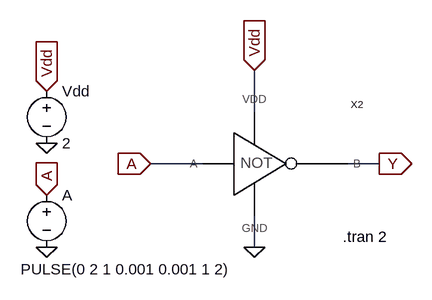
[diagram p0: schematic NOT_SYM_TESTING.asc]
NOT_SYM_TESTING.asc, the LTspice schematic file:
Version 4
SHEET 1 880 680
WIRE 208 112 208 48
WIRE 128 192 48 192
WIRE 400 192 352 192
WIRE 208 320 208 272
FLAG 208 320 0
FLAG -112 320 0
FLAG -112 160 0
FLAG 208 48 Vdd
IOPIN 208 48 In
FLAG 48 192 A
IOPIN 48 192 In
FLAG 400 192 Y
IOPIN 400 192 Out
FLAG -112 80 Vdd
IOPIN -112 80 In
FLAG -112 240 A
IOPIN -112 240 In
SYMBOL voltage -112 64 R0
WINDOW 123 0 0 Left 0
WINDOW 39 0 0 Left 0
SYMATTR InstName Vdd
SYMATTR Value 2
SYMBOL voltage -112 224 R0
WINDOW 3 -40 130 Left 2
WINDOW 123 0 0 Left 0
WINDOW 39 0 0 Left 0
SYMATTR Value PULSE(0 2 1 0.001 0.001 1 2)
SYMATTR InstName A
SYMBOL NOT_SYM 208 192 R0
SYMATTR InstName X2
TEXT 344 304 Left 2 !.tran 2

The netlist it stands for:
* NOT_SYM_TESTING.asc
Vdd Vdd 0 2
V§A A 0 PULSE(0 2 1 0.001 0.001 1 2)
XX2 A Vdd Y 0 NOT_SYM  ; pins A VDD B GND
.tran 2
.backanno
.end